# EAGLE design MEGA2560v3ProtoShield (EAGLE 7.7.0)
Mega 2560 Shield with 28-pin SOP
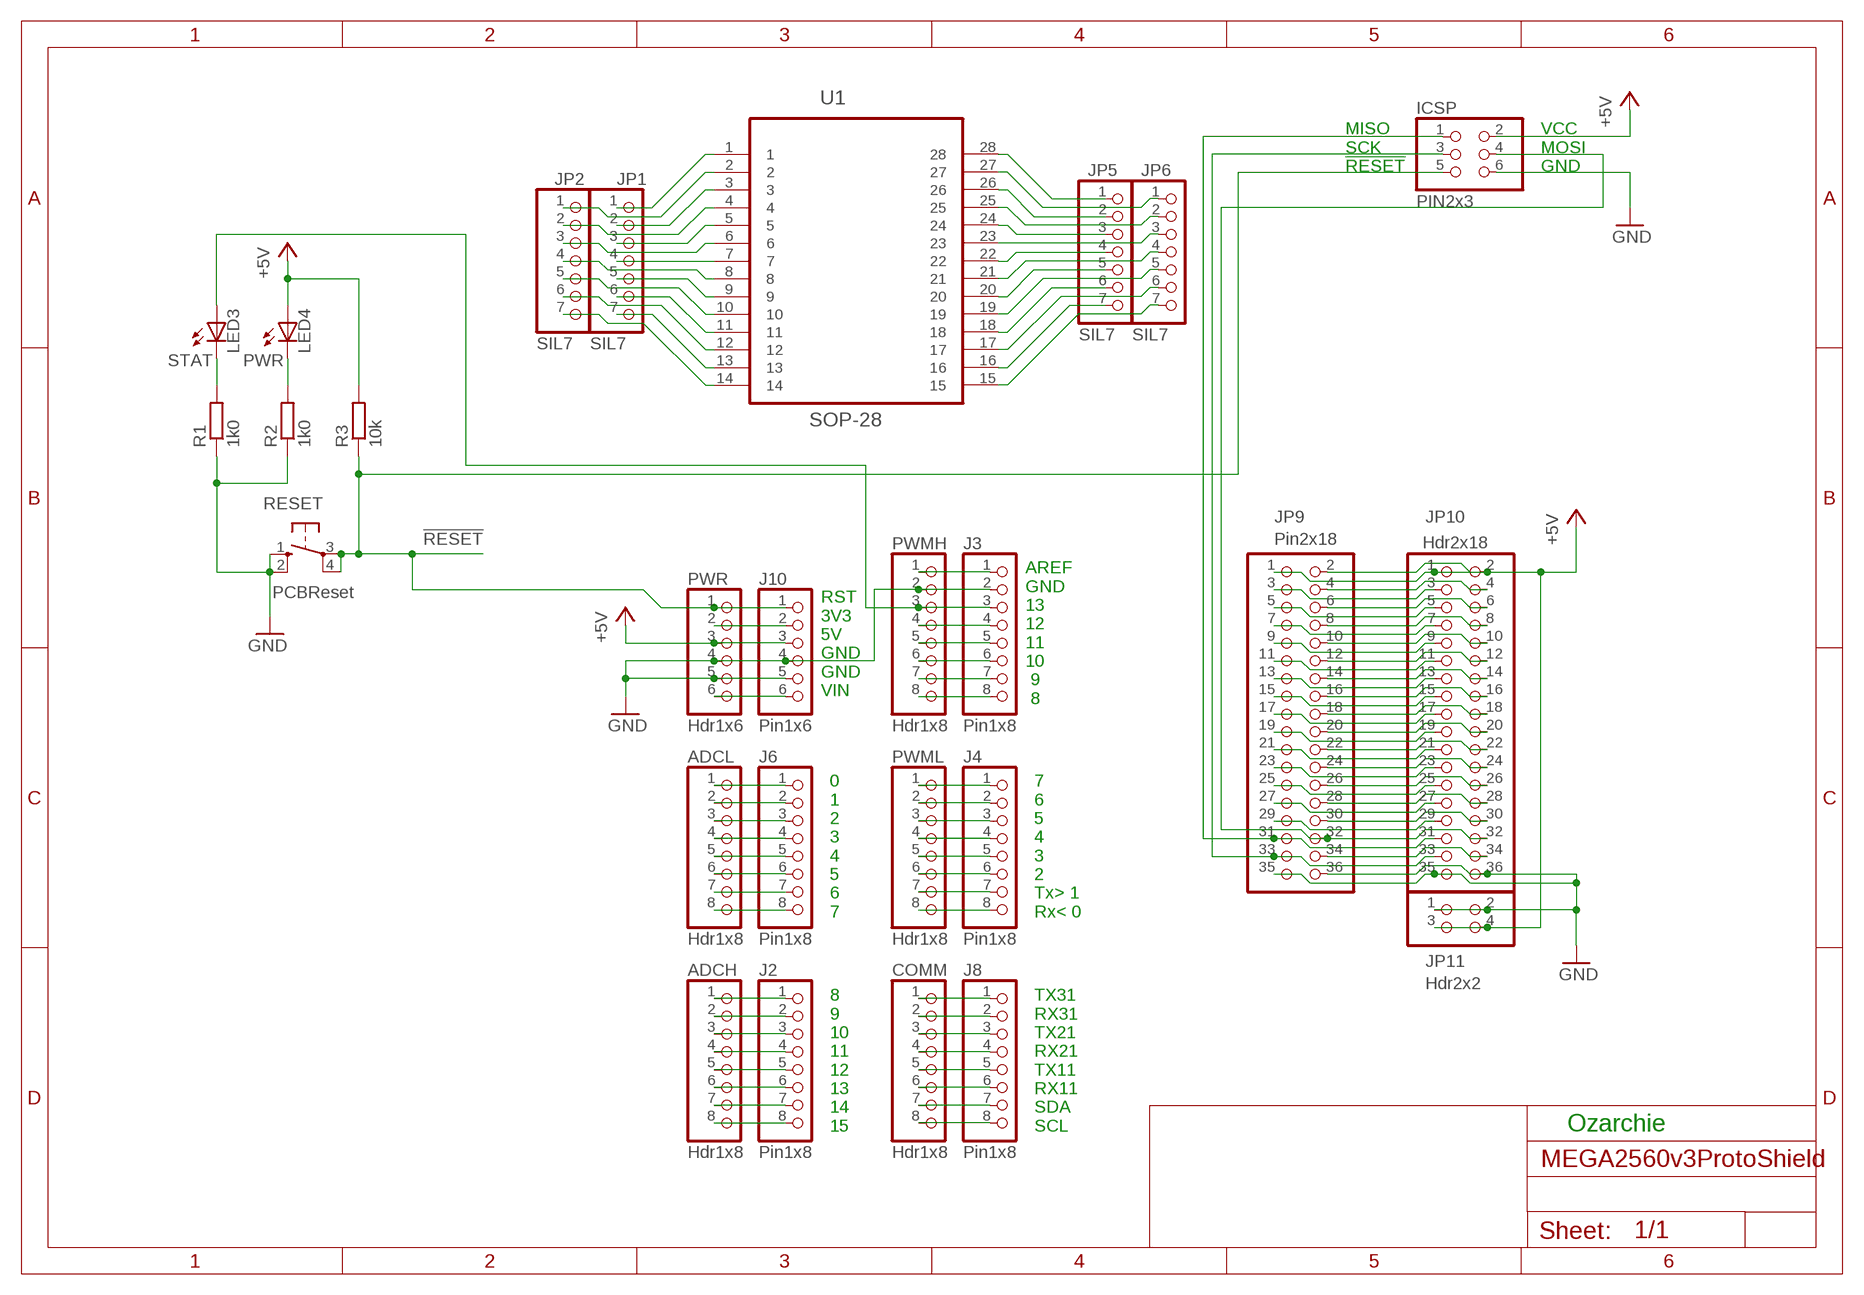
[diagram p0: schematic, sheet 1]

## Parts
ADCH  Hdr1x8  PINHD-1X8  [1X08]
ADCL  Hdr1x8  PINHD-1X8  [1X08]
COMM  Hdr1x8  PINHD-1X8  [1X08]
ICSP  PIN2x3  PINHD-2X3  [2X03]
J2  Pin1x8  PINHD-1X8  [1X08]
J3  Pin1x8  PINHD-1X8  [1X08]
J4  Pin1x8  PINHD-1X8  [1X08]
J6  Pin1x8  PINHD-1X8  [1X08]
J8  Pin1x8  PINHD-1X8  [1X08]
J10  Pin1x6  PINHD-1X6  [1X06]
JP1  SIL7  PINHD-1X7  [1X07]
JP2  SIL7  PINHD-1X7  [1X07]
JP5  SIL7  PINHD-1X7  [1X07]
JP6  SIL7  PINHD-1X7  [1X07]
JP9  Pin2x18  PINHD-2X18  [2X18]
JP10  Hdr2x18  PINHD-2X18  [2X18]
JP11  Hdr2x2  PINHD-2X2  [2X02]
LED3  STAT  LEDCHIPLED_1206  [CHIPLED_1206]
LED4  PWR  LEDCHIPLED_1206  [CHIPLED_1206]
PWMH  Hdr1x8  PINHD-1X8  [1X08]
PWML  Hdr1x8  PINHD-1X8  [1X08]
PWR  Hdr1x6  PINHD-1X6  [1X06]
R1  1k0  R-EU_R0805  [R0805]
R2  1k0  R-EU_R0805  [R0805]
R3  10k  R-EU_R0805  [R0805]
RESET  PCBReset  10-XX  [B3F-10XX]
U1  SOP-28  [SOP50P1030X264-28N]

## Nets
3V3: J10.2 PWR.2
!RESET!: ICSP.5 J10.1 PWR.1 R3.1 RESET.3(P) RESET.4(P1)
+5V: ICSP.2 J10.3 JP9.1 JP9.2 JP10.1 JP10.2 JP11.3 JP11.4 LED4.A PWR.3 R3.2
A0: ADCL.1 J6.1
A1: ADCL.2 J6.2
A2: ADCL.3 J6.3
A3: ADCL.4 J6.4
A4: ADCL.5 J6.5
A5: ADCL.6 J6.6
A6: ADCL.7 J6.7
A7: ADCL.8 J6.8
A8: ADCH.1 J2.1
A9: ADCH.2 J2.2
A10: ADCH.3 J2.3
A11: ADCH.4 J2.4
A12: ADCH.5 J2.5
A13: ADCH.6 J2.6
A14: ADCH.7 J2.7
A15: ADCH.8 J2.8
AREF: J3.1 PWMH.1
D0/RX0: J4.8 PWML.8
D1/TX0: J4.7 PWML.7
D2PWM: J4.6 PWML.6
D3PWM: J4.5 PWML.5
D4PWM: J4.4 PWML.4
D5PWM: J4.3 PWML.3
D6PWM: J4.2 PWML.2
D7PWM: J4.1 PWML.1
D8PWM: J3.8 PWMH.8
D9PWM: J3.7 PWMH.7
D10PWM: J3.6 PWMH.6
D11PWM: J3.5 PWMH.5
D12PWM: J3.4 PWMH.4
D13PWM: J3.3 LED3.A PWMH.3
D14/TX3: COMM.1 J8.1
D15/RX3: COMM.2 J8.2
D16/TX2: COMM.3 J8.3
D17/RX2: COMM.4 J8.4
D18/TX1: COMM.5 J8.5
D19/RX1: COMM.6 J8.6
D20/SDA: COMM.7 J8.7
D21/SCL: COMM.8 J8.8
D22: JP9.3 JP10.3
D23: JP9.4 JP10.4
D24: JP9.5 JP10.5
D25: JP9.6 JP10.6
D26: JP9.7 JP10.7
D27: JP9.8 JP10.8
D28: JP9.9 JP10.9
D29: JP9.10 JP10.10
D30: JP9.11 JP10.11
D31: JP9.12 JP10.12
D32: JP9.13 JP10.13
D33: JP9.14 JP10.14
D34: JP9.15 JP10.15
D35: JP9.16 JP10.16
D36: JP9.17 JP10.17
D37: JP9.18 JP10.18
D38: JP9.19 JP10.19
D39: JP9.20 JP10.20
D40: JP9.21 JP10.21
D41: JP9.22 JP10.22
D42: JP9.23 JP10.23
D43: JP9.24 JP10.24
D44: JP9.25 JP10.25
D45: JP9.26 JP10.26
D46: JP9.27 JP10.27
D47: JP9.28 JP10.28
D48: JP9.29 JP10.29
D49: JP9.30 JP10.30
D53: JP9.34 JP10.34
GND: ICSP.6 J3.2 J10.4 J10.5 JP9.35 JP9.36 JP10.35 JP10.36 JP11.1 JP11.2 PWMH.2 PWR.4 PWR.5 R1.1 R2.1 RESET.1(S) RESET.2(S1)
MISO: ICSP.1 JP9.31 JP10.31
MOSI: ICSP.4 JP9.32 JP10.32
N$10: LED3.C R1.2
N$11: LED4.C R2.2
SCK: ICSP.3 JP9.33 JP10.33
SO1: JP1.1 U1.1
SO2: JP2.1 U1.2
SO3: JP1.2 U1.3
SO4: JP2.2 U1.4
SO5: JP1.3 U1.5
SO6: JP2.3 U1.6
SO7: JP1.4 U1.7
SO8: JP2.4 U1.8
SO9: JP1.5 U1.9
SO10: JP2.5 U1.10
SO11: JP1.6 U1.11
SO12: JP2.6 U1.12
SO13: JP1.7 U1.13
SO14: JP2.7 U1.14
SO15: JP6.7 U1.15
SO16: JP5.7 U1.16
SO17: JP6.6 U1.17
SO18: JP5.6 U1.18
SO19: JP6.5 U1.19
SO20: JP5.5 U1.20
SO21: JP6.4 U1.21
SO22: JP5.4 U1.22
SO23: JP6.3 U1.23
SO24: JP5.3 U1.24
SO25: JP6.2 U1.25
SO26: JP5.2 U1.26
SO27: JP6.1 U1.27
SO28: JP5.1 U1.28
VIN: J10.6 PWR.6

## Notes on the sheet
- MISO
  SCK
  !RESET!
- VCC
  MOSI
  GND
- RST
  3V3
  5V
  GND
  GND
  VIN
- AREF
  GND
  13
  12
  11
  10
   9
   8
- 0
  1
  2
  3
  4
  5
  6
  7
- 7
  6
  5
  4
  3
  2
  Tx> 1
  Rx< 0
- 8
  9
  10
  11
  12
  13
  14
  15
- TX31
  RX31
  TX21
  RX21
  TX11
  RX11
  SDA
  SCL
- Ozarchie

## Library data of the parts
ADCH ADCL COMM J2-J4 J6 J8 PWMH PWML = MEGA2560v3ProtoShield:PINHD-1X8: PIN HEADER
ICSP = Smartprj:PINHD-2X3: PIN HEADER
J10 PWR = MEGA2560v3ProtoShield:PINHD-1X6: PIN HEADER
JP1 JP2 JP5 JP6 = MEGA2560v3ProtoShield:PINHD-1X7: PIN HEADER
JP9 JP10 = Smartprj:PINHD-2X18: PIN HEADER
JP11 = Smartprj:PINHD-2X2: PIN HEADER
LED3 LED4 = led:LED: LED OSRAM: - CHIPLED LG R971, LG N971, LY N971, LG Q971, LY Q971, LO R971, LY R971 LH N974, LH R974 LS Q976, LO Q976, LY Q976 LO Q996 - Hyper CHIPLED LW Q18S LB Q993, LB Q99A, LB R99A - SideLED LS A670, LO A670, LY A670, LG A670, LP A670 LB A673, LV A673, LT A673, LW A673 LH A674 LY A675 LS A676, LA A676, LO A676, LY A676, LW A676 LS A679, LY A679, LG A679 - Hyper Micro SIDELED® LS Y876, LA Y876, LO Y876, LY Y876 LT Y87S - SmartLED LW L88C, LW L88S LB L89C, LB L89S, LG L890 LS L89K, LO L89K, LY L89K LS L896, LA L896, LO L896, LY L896 - TOPLED LS T670, LO T670, LY T670, LG T670, LP T670 LSG T670, LSP T670, LSY T670, LOP T670, LYG T670 LG T671, LOG T671, LSG T671 LB T673, LV T673, LT T673, LW T673 LH T674 LS T676, LA T676, LO T676, LY T676, LB T676, LH T676, LSB T676, LW T676 LB T67C, LV T67C, LT T67C, LS T67K, LO T67K, LY T67K, LW E67C LS E67B, LA E67B, LO E67B, LY E67B, LB E67C, LV E67C, LT E67C LW T67C LS T679, LY T679, LG T679 LS T770, LO T770, LY T770, LG T770, LP T770 LB T773, LV T773, LT T773, LW T773 LH T774 LS E675, LA E675, LY E675, LS T675 LS T776, LA T776, LO T776, LY T776, LB T776 LHGB T686 LT T68C, LB T68C - Hyper Mini TOPLED® LB M676 - Mini TOPLED Santana® LG M470 LS M47K, LO M47K, LY M47K Source: http://www.osram.convergy.de LUXEON: - LUMILED® LXK2-PW12-R00, LXK2-PW12-S00, LXK2-PW14-U00, LXK2-PW14-V00 LXK2-PM12-R00, LXK2-PM12-S00, LXK2-PM14-U00 LXK2-PE12-Q00, LXK2-PE12-R00, LXK2-PE12-S00, LXK2-PE14-T00, LXK2-PE14-U00 LXK2-PB12-K00, LXK2-PB12-L00, LXK2-PB12-M00, LXK2-PB14-N00, LXK2-PB14-P00, LXK2-PB14-Q00 LXK2-PR12-L00, LXK2-PR12-M00, LXK2-PR14-Q00, LXK2-PR14-R00 LXK2-PD12-Q00, LXK2-PD12-R00, LXK2-PD12-S00 LXK2-PH12-R00, LXK2-PH12-S00 LXK2-PL12-P00, LXK2-PL12-Q00, LXK2-PL12-R00 Source: www.luxeon.com KINGBRIGHT: KA-3528ASYC Source: www.kingbright.com
R1-R3 = resistor:R-EU_: RESISTOR, European symbol
RESET = switch-omron:10-XX: OMRON SWITCH; MPN: B3F-1000; OC_FARNELL: 176432; OC_NEWARK: 36M3542
U1 = pmc:SOP-28: SOP28 PAD Pattern

## Board
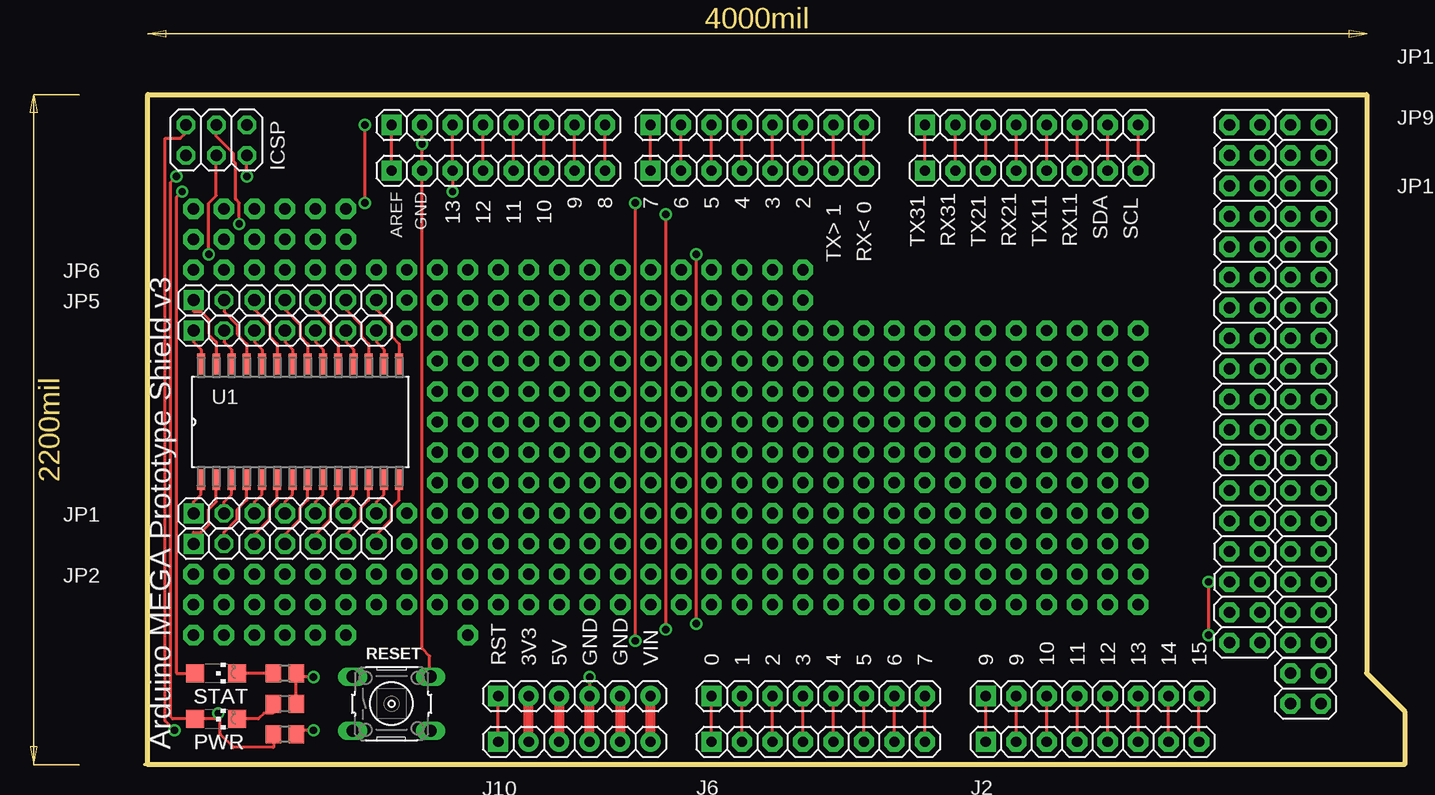
[diagram p1: board, top side]
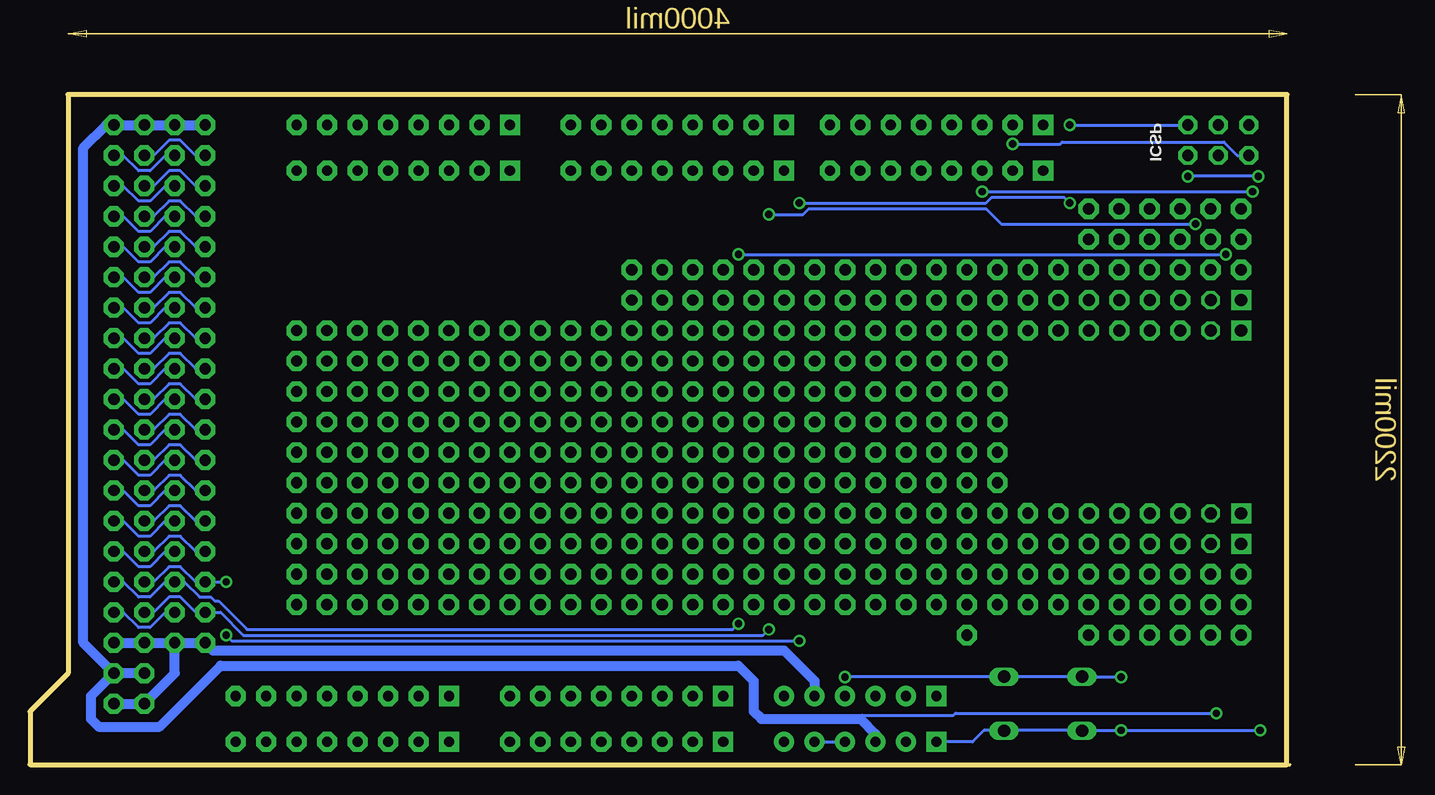
[diagram p2: board, bottom side, seen from below]

Size 105.05 x 55.88 mm. Coordinates in mm from the lower left corner, seen from the top.
Outline: 0.27,0 0,0
Outline: 0.27,0 0.27,55.88 101.87,55.88 101.87,7.62 105.05,4.45 105.05,0 0.27,0
Copper layers (1*16): Top 0.035mm / dielectric 1.5mm / Bottom 0.035mm
Design rules "default *": minimum track width 10mil, minimum drill 24mil, track to track 8mil, track to pad 8mil, pad to pad 8mil, via to via 8mil, smd to smd 8mil, copper to edge 40mil, drill to drill 8mil, minimum pad ring 10mil, minimum via ring 8mil, stop-mask expansion 2mil, vias tented up to drill 0mil, thermal gap 10mil

### Footprints (pad centres in the part's own frame; a part is rotated, then mirrored left to right if it is on the bottom)
1X08 = drill 0.85 pad 1.676 square: 1 -8.89,0 | drill 0.85 pad 1.676 octagon: 2 -6.35,0; 3 -3.81,0; 4 -1.27,0; 5 1.27,0; 6 3.81,0; 7 6.35,0; 8 8.89,0
2X03 = drill 0.95 pad 1.55 octagon: 1 -2.54,-1.27; 2 -2.54,1.27; 3 0,-1.27; 4 0,1.27; 5 2.54,-1.27; 6 2.54,1.27
1X06 = drill 0.85 pad 1.676 square: 1 -6.35,0 | drill 0.85 pad 1.676: 2 -3.81,0; 3 -1.27,0; 4 1.27,0; 5 3.81,0; 6 6.35,0
1X07 = drill 1.016 pad 1.676 square: 1 -7.62,0 | drill 1.016 octagon: 2 -5.08,0 | drill 1.016 pad 1.676 octagon: 3 -2.54,0; 4 0,0; 5 2.54,0; 6 5.08,0; 7 7.62,0
2X18 = drill 0.95 pad 1.676 octagon: 1 -21.59,-1.27; 2 -21.59,1.27; 3 -19.05,-1.27; 4 -19.05,1.27; 5 -16.51,-1.27; 6 -16.51,1.27; 7 -13.97,-1.27; 8 -13.97,1.27; 9 -11.43,-1.27; 10 -11.43,1.27; 11 -8.89,-1.27; 12 -8.89,1.27; 13 -6.35,-1.27; 14 -6.35,1.27; 15 -3.81,-1.27; 16 -3.81,1.27; 17 -1.27,-1.27; 18 -1.27,1.27; 19 1.27,-1.27; 20 1.27,1.27; 21 3.81,-1.27; 22 3.81,1.27; 23 6.35,-1.27; 24 6.35,1.27; 25 8.89,-1.27; 26 8.89,1.27; 27 11.43,-1.27; 28 11.43,1.27; 29 13.97,-1.27; 30 13.97,1.27; 31 16.51,-1.27; 32 16.51,1.27; 33 19.05,-1.27; 34 19.05,1.27; 35 21.59,-1.27; 36 21.59,1.27
2X02 = drill 0.95 pad 1.676 octagon: 1 -1.27,-1.27; 2 -1.27,1.27; 3 1.27,-1.27; 4 1.27,1.27
CHIPLED_1206 = smd 1.5 x 1.5: A 0,-1.75; C 0,1.75
R0805 = smd 1.3 x 1.5: 1 -0.95,0; 2 0.95,0
B3F-10XX = drill 1.016 long: 1 -3.251,2.261; 2 3.251,2.261; 3 -3.251,-2.261; 4 3.251,-2.261
SOP50P1030X264-28N = smd 1.727 x 0.66: 1 -4.826,8.255; 2 -4.826,6.985; 3 -4.826,5.715; 4 -4.826,4.445; 5 -4.826,3.175; 6 -4.826,1.905; 7 -4.826,0.635; 8 -4.826,-0.635; 9 -4.826,-1.905; 10 -4.826,-3.175; 11 -4.826,-4.445; 12 -4.826,-5.715; 13 -4.826,-6.985; 14 -4.826,-8.255; 15 4.826,-8.255; 16 4.826,-6.985; 17 4.826,-5.715; 18 4.826,-4.445; 19 4.826,-3.175; 20 4.826,-1.905; 21 4.826,-0.635; 22 4.826,0.635; 23 4.826,1.905; 24 4.826,3.175; 25 4.826,4.445; 26 4.826,5.715; 27 4.826,6.985; 28 4.826,8.255

### Placement (x,y rotation side)
ADCH  79.01,1.91 0 top
ADCL  56.15,1.91 0 top
COMM  73.93,49.53 0 top
ICSP  5.98,52.07 180 top
J2  79.01,5.71 0 top
J3  29.48,53.34 0 top
J4  51.07,53.34 0 top
J6  56.15,5.71 0 top
J8  73.93,53.34 0 top
J10  35.83,5.71 0 top
JP1  11.7,20.95 0 top
JP2  11.7,18.41 0 top
JP5  11.7,36.2 0 top
JP6  11.7,38.73 0 top
JP9  96.79,31.75 270 top
JP10  91.71,31.75 270 top
JP11  96.79,6.35 90 top
LED3  5.98,7.62 270 top
LED4  5.98,3.81 270 top
PWMH  29.48,49.53 0 top
PWML  51.07,49.53 0 top
PWR  35.83,1.91 0 top
R1  11.7,7.62 180 top
R2  11.7,5.08 180 top
R3  11.7,2.54 180 top
RESET  20.59,5.08 0 top
U1  12.97,28.57 90 top

### Tracks (layer width: path | path; a pad name or v marks a point on that pad's centre or on a via)
3V3
  Top 0.813: PWR.2 J10.2
!RESET!  (via drill 0.61)
  Top 0.254: PWR.1 J10.1 | v14.08,2.86 12.97,2.86 R3.1 | ICSP.5 3.44,52.7 2.97,52.23 1.7,52.23 1.7,3.65 v2.49,2.86
  Bottom 0.254: v2.49,2.86 v14.08,2.86 17.26,2.86 RESET.3 17.41,2.86 23.77,2.86 RESET.4 23.92,2.86 25.51,2.86 26.46,1.91 PWR.1
+5V  (via drill 0.61)
  Top 0.254: 6.14,3.81 6.3,3.81 6.3,2.54 7.41,1.43 10.75,1.43 R3.2 | 6.14,3.81 LED4.A 2.33,3.81 2.17,3.97 2.17,48.58 v2.65,49.05 | v8.53,49.05 ICSP.2 | v6.14,4.29 6.14,3.81
  Top 0.813: J10.3 PWR.3
  Bottom 0.254: v2.65,49.05 v8.53,49.05 | v6.14,4.29 27.89,4.29 28.05,4.13 35.67,4.13 35.83,3.81
  Bottom 0.813: JP11.3 100.6,10.16 100.6,51.44 98.69,53.34 JP9.2 JP9.1 JP10.2 JP10.1 | PWR.3 34.56,2.54 35.83,3.81 44.09,3.81 44.72,4.45 44.72,6.99 45.99,8.26 89.17,8.26 94.25,3.17 99.33,3.17 99.96,3.81 99.96,5.71 JP11.3 | JP11.4 JP11.3
A0
  Top 0.254: ADCL.1 J6.1
A1
  Top 0.254: ADCL.2 J6.2
A2
  Top 0.254: ADCL.3 J6.3
A3
  Top 0.254: ADCL.4 J6.4
A4
  Top 0.254: ADCL.5 J6.5
A5
  Top 0.254: ADCL.6 J6.6
A6
  Top 0.254: ADCL.7 J6.7
A7
  Top 0.254: ADCL.8 J6.8
A8
  Top 0.254: ADCH.1 J2.1
A9
  Top 0.254: ADCH.2 J2.2
A10
  Top 0.254: ADCH.3 J2.3
A11
  Top 0.254: ADCH.4 J2.4
A12
  Top 0.254: ADCH.5 J2.5
A13
  Top 0.254: ADCH.6 J2.6
A14
  Top 0.254: ADCH.7 J2.7
A15
  Top 0.254: ADCH.8 J2.8
AREF
  Top 0.254: PWMH.1 J3.1
D0/RX0
  Top 0.254: PWML.8 J4.8
D1/TX0
  Top 0.254: PWML.7 J4.7
D2PWM
  Top 0.254: PWML.6 J4.6
D3PWM
  Top 0.254: PWML.5 J4.5
D4PWM
  Top 0.254: PWML.4 J4.4
D5PWM
  Top 0.254: PWML.3 J4.3
D6PWM
  Top 0.254: PWML.2 J4.2
D7PWM
  Top 0.254: PWML.1 J4.1
D8PWM
  Top 0.254: PWMH.8 J3.8
D9PWM
  Top 0.254: PWMH.7 J3.7
D10PWM
  Top 0.254: PWMH.6 J3.6
D11PWM
  Top 0.254: PWMH.5 J3.5
D12PWM
  Top 0.254: PWMH.4 J3.4
D13PWM  (via drill 0.61)
  Top 0.254: J3.3 PWMH.3 v25.67,47.78 | LED3.A 2.65,7.62 2.65,47.31 v3.13,47.78
  Bottom 0.254: v25.67,47.78 v3.13,47.78
D14/TX3
  Top 0.254: COMM.1 J8.1
D15/RX3
  Top 0.254: COMM.2 J8.2
D16/TX2
  Top 0.254: COMM.3 J8.3
D17/RX2
  Top 0.254: COMM.4 J8.4
D18/TX1
  Top 0.254: COMM.5 J8.5
D19/RX1
  Top 0.254: COMM.6 J8.6
D20/SDA
  Top 0.254: COMM.7 J8.7
D21/SCL
  Top 0.254: COMM.8 J8.8
D22
  Bottom 0.254: JP9.3 94.73,50.8 93.46,52.07 92.5,52.07 91.23,50.8 JP10.3
D23
  Bottom 0.254: JP9.4 97.27,50.8 96,49.53 95.04,49.53 93.77,50.8 JP10.4
D24
  Bottom 0.254: JP9.5 94.73,48.26 93.46,49.53 92.5,49.53 91.23,48.26 JP10.5
D25
  Bottom 0.254: JP9.6 97.27,48.26 96,46.99 95.04,46.99 93.77,48.26 JP10.6
D26
  Bottom 0.254: JP9.7 94.73,45.72 93.46,46.99 92.5,46.99 91.23,45.72 JP10.7
D27
  Bottom 0.254: JP9.8 97.27,45.72 96,44.45 95.04,44.45 93.77,45.72 JP10.8
D28
  Bottom 0.254: JP9.9 94.73,43.18 93.46,44.45 92.5,44.45 91.23,43.18 JP10.9
D29
  Bottom 0.254: JP9.10 97.27,43.18 96,41.91 95.04,41.91 93.77,43.18 JP10.10
D30
  Bottom 0.254: JP9.11 94.73,40.64 93.46,41.91 92.5,41.91 91.23,40.64 JP10.11
D31
  Bottom 0.254: JP9.12 97.27,40.64 96,39.37 95.04,39.37 93.77,40.64 JP10.12
D32
  Bottom 0.254: JP9.13 94.73,38.1 93.46,39.37 92.5,39.37 91.23,38.1 JP10.13
D33
  Bottom 0.254: JP9.14 97.27,38.1 96,36.83 95.04,36.83 93.77,38.1 JP10.14
D34
  Bottom 0.254: JP9.15 94.73,35.56 93.46,36.83 92.5,36.83 91.23,35.56 JP10.15
D35
  Bottom 0.254: JP9.16 97.27,35.56 96,34.29 95.04,34.29 93.77,35.56 JP10.16
D36
  Bottom 0.254: JP9.17 94.73,33.02 93.46,34.29 92.5,34.29 91.23,33.02 JP10.17
D37
  Bottom 0.254: JP9.18 97.27,33.02 96,31.75 95.04,31.75 93.77,33.02 JP10.18
D38
  Bottom 0.254: JP9.19 94.73,30.48 93.46,31.75 92.5,31.75 91.23,30.48 JP10.19
D39
  Bottom 0.254: JP9.20 97.27,30.48 96,29.21 95.04,29.21 93.77,30.48 JP10.20
D40
  Bottom 0.254: JP9.21 94.73,27.94 93.46,29.21 92.5,29.21 91.23,27.94 JP10.21
D41
  Bottom 0.254: JP9.22 97.27,27.94 96,26.67 95.04,26.67 93.77,27.94 JP10.22
D42
  Bottom 0.254: JP9.23 94.73,25.4 93.46,26.67 92.5,26.67 91.23,25.4 JP10.23
D43
  Bottom 0.254: JP9.24 97.27,25.4 96,24.13 95.04,24.13 93.77,25.4 JP10.24
D44
  Bottom 0.254: JP9.25 94.73,22.86 93.46,24.13 92.5,24.13 91.23,22.86 JP10.25
D45
  Bottom 0.254: JP9.26 97.27,22.86 96,21.59 95.04,21.59 93.77,22.86 JP10.26
D46
  Bottom 0.254: JP9.27 94.73,20.32 93.46,21.59 92.5,21.59 91.23,20.32 JP10.27
D47
  Bottom 0.254: JP9.28 97.27,20.32 96,19.05 95.04,19.05 93.77,20.32 JP10.28
D48
  Bottom 0.254: JP9.29 94.73,17.78 93.46,19.05 92.5,19.05 91.23,17.78 JP10.29
D49
  Bottom 0.254: JP9.30 97.27,17.78 96,16.51 95.04,16.51 93.77,17.78 JP10.30
D53
  Bottom 0.254: JP9.34 97.27,12.7 96,11.43 95.04,11.43 93.77,12.7 JP10.34
GND  (via drill 0.61)
  Top 0.254: J3.2 v23.13,51.75 PWMH.2 23.13,9.68 23.77,9.05 23.77,7.46 RESET.2 | 12.65,7.3 R2.1 | 12.65,7.3 R1.1 12.65,7.3 | v14.08,7.3 12.65,7.3 | v37.1,7.3 J10.4
  Top 0.813: J10.5 PWR.5 | PWR.4 J10.4
  Bottom 0.254: ICSP.6 4.4,50.8 5.51,51.91 19,51.91 19.16,51.75 v23.13,51.75 | PWR.5 PWR.4 | v14.08,7.3 17.26,7.3 RESET.1 17.41,7.3 23.77,7.3 RESET.2 23.92,7.3 v37.1,7.3
  Bottom 0.813: JP9.36 JP9.35 JP10.36 | JP10.36 JP10.35 89.8,9.53 42.18,9.53 39.64,6.99 J10.5 | JP11.1 JP11.2 92.98,7.62 JP10.36
MISO  (via drill 0.61)
  Top 0.254: v18.37,46.83 v18.37,53.34 | v40.91,10.32 v40.91,46.83 | v88.69,15.24 v88.69,10.79
  Bottom 0.254: JP9.31 94.73,15.24 93.46,16.51 92.5,16.51 91.23,15.24 JP10.31 v88.69,15.24 | v18.37,53.34 ICSP.1 | v18.37,46.83 18.84,47.31 24.88,47.31 25.35,46.83 v40.91,46.83 | v40.91,10.32 88.22,10.32 v88.69,10.79
MOSI  (via drill 0.61)
  Top 0.254: ICSP.4 5.98,47.47 5.35,46.83 v5.35,42.55 | v45.99,11.75 v45.99,42.55
  Bottom 0.254: JP9.32 97.27,15.24 96,13.97 95.04,13.97 93.77,15.24 JP10.32 92.19,15.24 90.92,13.97 89.96,13.97 89.65,13.65 89.33,13.65 86.95,11.27 46.47,11.27 v45.99,11.75 | v45.99,42.55 v5.35,42.55
N$4  (via drill 0.95 pad 1.7)
  other vias: 72.66,15.88
N$10
  Top 0.254: R1.2 LED3.C
N$11
  Top 0.254: LED4.C 9.48,3.81 9.95,4.29 10.75,4.29 R2.2
N$13  (via drill 0.95 pad 1.7)
  other vias: 6.62,41.27
N$14  (via drill 0.95 pad 1.7)
  other vias: 4.08,41.27
N$16  (via drill 0.95 pad 1.7)
  other vias: 6.62,43.81
N$17  (via drill 0.95 pad 1.7)
  other vias: 6.62,46.35
N$25  (via drill 0.95 pad 1.7)
  other vias: 9.16,41.27
N$26  (via drill 0.95 pad 1.7)
  other vias: 11.7,41.27
N$27  (via drill 0.95 pad 1.7)
  other vias: 16.78,41.27
N$28  (via drill 0.95 pad 1.7)
  other vias: 14.24,41.27
N$29  (via drill 0.95 pad 1.7)
  other vias: 14.24,43.81
N$30  (via drill 0.95 pad 1.7)
  other vias: 11.7,43.81
N$31  (via drill 0.95 pad 1.7)
  other vias: 9.16,43.81
N$32  (via drill 0.95 pad 1.7)
  other vias: 9.16,46.35
N$33  (via drill 0.95 pad 1.7)
  other vias: 11.7,46.35
N$34  (via drill 0.95 pad 1.7)
  other vias: 16.78,43.81
N$35  (via drill 0.95 pad 1.7)
  other vias: 16.78,46.35
N$36  (via drill 0.95 pad 1.7)
  other vias: 14.24,46.35
N$37  (via drill 0.95 pad 1.7)
  other vias: 4.08,43.81
N$39  (via drill 0.95 pad 1.7)
  other vias: 4.08,46.35
N$40  (via drill 0.95 pad 1.7)
  other vias: 6.62,10.79
N$41  (via drill 0.95 pad 1.7)
  other vias: 4.08,10.79
N$42  (via drill 0.95 pad 1.7)
  other vias: 6.62,13.34
N$43  (via drill 0.95 pad 1.7)
  other vias: 6.62,15.88
N$44  (via drill 0.95 pad 1.7)
  other vias: 9.16,10.79
N$45  (via drill 0.95 pad 1.7)
  other vias: 65.04,15.88
N$46  (via drill 0.95 pad 1.7)
  other vias: 65.04,31.11
N$47  (via drill 0.95 pad 1.7)
  other vias: 65.04,28.57
N$48  (via drill 0.95 pad 1.7)
  other vias: 11.7,10.79
N$49  (via drill 0.95 pad 1.7)
  other vias: 65.04,26.04
N$50  (via drill 0.95 pad 1.7)
  other vias: 14.24,10.79
N$51  (via drill 0.95 pad 1.7)
  other vias: 14.24,13.34
N$52  (via drill 0.95 pad 1.7)
  other vias: 11.7,13.34
N$53  (via drill 0.95 pad 1.7)
  other vias: 9.16,13.34
N$54  (via drill 0.95 pad 1.7)
  other vias: 9.16,15.88
N$55  (via drill 0.95 pad 1.7)
  other vias: 11.7,15.88
N$56  (via drill 0.95 pad 1.7)
  other vias: 16.78,13.34
N$57  (via drill 0.95 pad 1.7)
  other vias: 65.04,23.5
N$58  (via drill 0.95 pad 1.7)
  other vias: 65.04,20.95
N$59  (via drill 0.95 pad 1.7)
  other vias: 65.04,18.41
N$60  (via drill 0.95 pad 1.7)
  other vias: 16.78,15.88
N$61  (via drill 0.95 pad 1.7)
  other vias: 14.24,15.88
N$62  (via drill 0.95 pad 1.7)
  other vias: 4.08,13.34
N$65  (via drill 0.95 pad 1.7)
  other vias: 4.08,15.88
N$66  (via drill 0.95 pad 1.7)
  other vias: 19.32,41.27
N$67  (via drill 0.95 pad 1.7)
  other vias: 24.4,41.27
N$68  (via drill 0.95 pad 1.7)
  other vias: 21.86,41.27
N$69  (via drill 0.95 pad 1.7)
  other vias: 44.72,13.34
N$70  (via drill 0.95 pad 1.7)
  other vias: 29.48,13.34
N$71  (via drill 0.95 pad 1.7)
  other vias: 26.94,13.34
N$72  (via drill 0.95 pad 1.7)
  other vias: 24.4,36.2
N$73  (via drill 0.95 pad 1.7)
  other vias: 21.86,36.2
N$74  (via drill 0.95 pad 1.7)
  other vias: 24.4,38.73
N$75  (via drill 0.95 pad 1.7)
  other vias: 21.86,38.73
N$76  (via drill 0.95 pad 1.7)
  other vias: 65.04,33.66
N$77  (via drill 0.95 pad 1.7)
  other vias: 26.94,10.79
N$78  (via drill 0.95 pad 1.7)
  other vias: 24.4,13.34
N$79  (via drill 0.95 pad 1.7)
  other vias: 24.4,15.88
N$80  (via drill 0.95 pad 1.7)
  other vias: 24.4,18.41
N$81  (via drill 0.95 pad 1.7)
  other vias: 59.96,15.88
N$82  (via drill 0.95 pad 1.7)
  other vias: 29.48,15.88
N$83  (via drill 0.95 pad 1.7)
  other vias: 26.94,15.88
N$84  (via drill 0.95 pad 1.7)
  other vias: 24.4,20.95
N$85  (via drill 0.95 pad 1.7)
  other vias: 24.4,23.5
N$86  (via drill 0.95 pad 1.7)
  other vias: 24.4,26.04
N$87  (via drill 0.95 pad 1.7)
  other vias: 24.4,31.11
N$90  (via drill 0.95 pad 1.7)
  other vias: 24.4,33.66
N$91  (via drill 0.95 pad 1.7)
  other vias: 54.88,28.57
N$92  (via drill 0.95 pad 1.7)
  other vias: 24.4,28.57
N$93  (via drill 0.95 pad 1.7)
  other vias: 62.5,18.41
N$94  (via drill 0.95 pad 1.7)
  other vias: 29.48,18.41
N$95  (via drill 0.95 pad 1.7)
  other vias: 26.94,18.41
N$96  (via drill 0.95 pad 1.7)
  other vias: 59.96,28.57
N$105  (via drill 0.95 pad 1.7)
  other vias: 70.12,20.95
N$106  (via drill 0.95 pad 1.7)
  other vias: 29.48,20.95
N$107  (via drill 0.95 pad 1.7)
  other vias: 26.94,20.95
N$108  (via drill 0.95 pad 1.7)
  other vias: 62.5,26.04
N$114  (via drill 0.95 pad 1.7)
  other vias: 59.96,26.04
N$115  (via drill 0.95 pad 1.7)
  other vias: 59.96,20.95
N$117  (via drill 0.95 pad 1.7)
  other vias: 62.5,23.5
N$118  (via drill 0.95 pad 1.7)
  other vias: 21.86,20.95
N$119  (via drill 0.95 pad 1.7)
  other vias: 29.48,23.5
N$120  (via drill 0.95 pad 1.7)
  other vias: 26.94,23.5
N$122  (via drill 0.95 pad 1.7)
  other vias: 54.88,20.95
N$123  (via drill 0.95 pad 1.7)
  other vias: 26.94,41.27
N$131  (via drill 0.95 pad 1.7)
  other vias: 29.48,26.04
N$132  (via drill 0.95 pad 1.7)
  other vias: 26.94,26.04
N$135  (via drill 0.95 pad 1.7)
  other vias: 26.94,28.57
N$141  (via drill 0.95 pad 1.7)
  other vias: 67.58,15.88
N$143  (via drill 0.95 pad 1.7)
  other vias: 29.48,28.57
N$153  (via drill 0.95 pad 1.7)
  other vias: 57.42,31.11
N$155  (via drill 0.95 pad 1.7)
  other vias: 29.48,31.11
N$156  (via drill 0.95 pad 1.7)
  other vias: 26.94,31.11
N$165  (via drill 0.95 pad 1.7)
  other vias: 52.34,33.66
N$167  (via drill 0.95 pad 1.7)
  other vias: 29.48,33.66
N$168  (via drill 0.95 pad 1.7)
  other vias: 26.94,33.66
N$177  (via drill 0.95 pad 1.7)
  other vias: 44.72,36.2
N$178  (via drill 0.95 pad 1.7)
  other vias: 67.58,31.11
N$179  (via drill 0.95 pad 1.7)
  other vias: 29.48,36.2
N$180  (via drill 0.95 pad 1.7)
  other vias: 26.94,36.2
N$185  (via drill 0.95 pad 1.7)
  other vias: 70.12,36.2
N$186  (via drill 0.95 pad 1.7)
  other vias: 70.12,31.11
N$187  (via drill 0.95 pad 1.7)
  other vias: 70.12,28.57
N$188  (via drill 0.95 pad 1.7)
  other vias: 70.12,26.04
N$189  (via drill 0.95 pad 1.7)
  other vias: 16.78,10.79
N$190  (via drill 0.95 pad 1.7)
  other vias: 21.86,18.41
N$191  (via drill 0.95 pad 1.7)
  other vias: 29.48,38.73
N$192  (via drill 0.95 pad 1.7)
  other vias: 26.94,38.73
N$193  (via drill 0.95 pad 1.7)
  other vias: 70.12,23.5
N$194  (via drill 0.95 pad 1.7)
  other vias: 70.12,18.41
N$197  (via drill 0.95 pad 1.7)
  other vias: 70.12,33.66
N$198  (via drill 0.95 pad 1.7)
  other vias: 72.66,31.11
N$199  (via drill 0.95 pad 1.7)
  other vias: 72.66,28.57
N$200  (via drill 0.95 pad 1.7)
  other vias: 72.66,26.04
N$201  (via drill 0.95 pad 1.7)
  other vias: 39.64,41.27
N$202  (via drill 0.95 pad 1.7)
  other vias: 72.66,23.5
N$203  (via drill 0.95 pad 1.7)
  other vias: 29.48,41.27
N$204  (via drill 0.95 pad 1.7)
  other vias: 72.66,20.95
N$205  (via drill 0.95 pad 1.7)
  other vias: 72.66,18.41
N$208  (via drill 0.95 pad 1.7)
  other vias: 72.66,36.2
N$209  (via drill 0.95 pad 1.7)
  other vias: 72.66,33.66
N$210  (via drill 0.95 pad 1.7)
  other vias: 75.2,15.88
N$211  (via drill 0.95 pad 1.7)
  other vias: 75.2,31.11
N$212  (via drill 0.95 pad 1.7)
  other vias: 75.2,28.57
N$213  (via drill 0.95 pad 1.7)
  other vias: 75.2,26.04
N$214  (via drill 0.95 pad 1.7)
  other vias: 75.2,23.5
N$215  (via drill 0.95 pad 1.7)
  other vias: 75.2,20.95
N$216  (via drill 0.95 pad 1.7)
  other vias: 75.2,18.41
N$219  (via drill 0.95 pad 1.7)
  other vias: 34.56,26.04
N$220  (via drill 0.95 pad 1.7)
  other vias: 37.1,26.04
N$221  (via drill 0.95 pad 1.7)
  other vias: 75.2,36.2
N$224  (via drill 0.95 pad 1.7)
  other vias: 75.2,33.66
N$225  (via drill 0.95 pad 1.7)
  other vias: 77.74,15.88
N$226  (via drill 0.95 pad 1.7)
  other vias: 77.74,31.11
N$227  (via drill 0.95 pad 1.7)
  other vias: 32.02,36.2
N$228  (via drill 0.95 pad 1.7)
  other vias: 34.56,36.2
N$229  (via drill 0.95 pad 1.7)
  other vias: 32.02,33.66
N$230  (via drill 0.95 pad 1.7)
  other vias: 34.56,33.66
N$231  (via drill 0.95 pad 1.7)
  other vias: 32.02,31.11
N$232  (via drill 0.95 pad 1.7)
  other vias: 34.56,31.11
N$233  (via drill 0.95 pad 1.7)
  other vias: 37.1,33.66
N$234  (via drill 0.95 pad 1.7)
  other vias: 37.1,31.11
N$235  (via drill 0.95 pad 1.7)
  other vias: 34.56,28.57
N$236  (via drill 0.95 pad 1.7)
  other vias: 37.1,28.57
N$237  (via drill 0.95 pad 1.7)
  other vias: 39.64,31.11
N$238  (via drill 0.95 pad 1.7)
  other vias: 39.64,33.66
N$239  (via drill 0.95 pad 1.7)
  other vias: 39.64,28.57
N$240  (via drill 0.95 pad 1.7)
  other vias: 42.18,31.11
N$241  (via drill 0.95 pad 1.7)
  other vias: 42.18,33.66
N$242  (via drill 0.95 pad 1.7)
  other vias: 39.64,36.2
N$243  (via drill 0.95 pad 1.7)
  other vias: 37.1,36.2
N$244  (via drill 0.95 pad 1.7)
  other vias: 77.74,28.57
N$245  (via drill 0.95 pad 1.7)
  other vias: 34.56,38.73
N$246  (via drill 0.95 pad 1.7)
  other vias: 37.1,38.73
N$247  (via drill 0.95 pad 1.7)
  other vias: 32.02,38.73
N$248  (via drill 0.95 pad 1.7)
  other vias: 32.02,41.27
N$249  (via drill 0.95 pad 1.7)
  other vias: 34.56,41.27
N$250  (via drill 0.95 pad 1.7)
  other vias: 77.74,26.04
N$251  (via drill 0.95 pad 1.7)
  other vias: 32.02,28.57
N$252  (via drill 0.95 pad 1.7)
  other vias: 32.02,26.04
N$253  (via drill 0.95 pad 1.7)
  other vias: 77.74,23.5
N$254  (via drill 0.95 pad 1.7)
  other vias: 77.74,20.95
N$255  (via drill 0.95 pad 1.7)
  other vias: 77.74,18.41
N$258  (via drill 0.95 pad 1.7)
  other vias: 77.74,36.2
N$259  (via drill 0.95 pad 1.7)
  other vias: 34.56,20.95
N$260  (via drill 0.95 pad 1.7)
  other vias: 77.74,33.66
N$261  (via drill 0.95 pad 1.7)
  other vias: 37.1,20.95
N$262  (via drill 0.95 pad 1.7)
  other vias: 39.64,20.95
N$263  (via drill 0.95 pad 1.7)
  other vias: 42.18,20.95
N$264  (via drill 0.95 pad 1.7)
  other vias: 80.28,15.88
N$265  (via drill 0.95 pad 1.7)
  other vias: 80.28,31.11
N$266  (via drill 0.95 pad 1.7)
  other vias: 80.28,28.57
N$267  (via drill 0.95 pad 1.7)
  other vias: 44.72,28.57
N$268  (via drill 0.95 pad 1.7)
  other vias: 42.18,28.57
N$269  (via drill 0.95 pad 1.7)
  other vias: 47.26,28.57
N$270  (via drill 0.95 pad 1.7)
  other vias: 80.28,26.04
N$271  (via drill 0.95 pad 1.7)
  other vias: 32.02,23.5
N$272  (via drill 0.95 pad 1.7)
  other vias: 32.02,20.95
N$273  (via drill 0.95 pad 1.7)
  other vias: 32.02,18.41
N$274  (via drill 0.95 pad 1.7)
  other vias: 34.56,13.34
N$275  (via drill 0.95 pad 1.7)
  other vias: 34.56,15.88
N$276  (via drill 0.95 pad 1.7)
  other vias: 39.64,15.88
N$277  (via drill 0.95 pad 1.7)
  other vias: 37.1,15.88
N$278  (via drill 0.95 pad 1.7)
  other vias: 37.1,13.34
N$279  (via drill 0.95 pad 1.7)
  other vias: 32.02,13.34
N$280  (via drill 0.95 pad 1.7)
  other vias: 32.02,15.88
N$281  (via drill 0.95 pad 1.7)
  other vias: 39.64,18.41
N$282  (via drill 0.95 pad 1.7)
  other vias: 42.18,18.41
N$283  (via drill 0.95 pad 1.7)
  other vias: 39.64,13.34
N$284  (via drill 0.95 pad 1.7)
  other vias: 67.58,28.57
N$285  (via drill 0.95 pad 1.7)
  other vias: 67.58,26.04
N$286  (via drill 0.95 pad 1.7)
  other vias: 67.58,23.5
N$287  (via drill 0.95 pad 1.7)
  other vias: 80.28,23.5
N$288  (via drill 0.95 pad 1.7)
  other vias: 80.28,20.95
N$289  (via drill 0.95 pad 1.7)
  other vias: 67.58,20.95
N$290  (via drill 0.95 pad 1.7)
  other vias: 67.58,18.41
N$291  (via drill 0.95 pad 1.7)
  other vias: 67.58,33.66
N$292  (via drill 0.95 pad 1.7)
  other vias: 65.04,13.34
N$293  (via drill 0.95 pad 1.7)
  other vias: 42.18,15.88
N$294  (via drill 0.95 pad 1.7)
  other vias: 44.72,15.88
N$295  (via drill 0.95 pad 1.7)
  other vias: 44.72,18.41
N$296  (via drill 0.95 pad 1.7)
  other vias: 47.26,18.41
N$297  (via drill 0.95 pad 1.7)
  other vias: 47.26,20.95
N$298  (via drill 0.95 pad 1.7)
  other vias: 44.72,20.95
N$299  (via drill 0.95 pad 1.7)
  other vias: 49.8,20.95
N$300  (via drill 0.95 pad 1.7)
  other vias: 80.28,18.41
N$303  (via drill 0.95 pad 1.7)
  other vias: 80.28,36.2
N$304  (via drill 0.95 pad 1.7)
  other vias: 52.34,28.57
N$305  (via drill 0.95 pad 1.7)
  other vias: 49.8,28.57
N$306  (via drill 0.95 pad 1.7)
  other vias: 80.28,33.66
N$307  (via drill 0.95 pad 1.7)
  other vias: 47.26,31.11
N$308  (via drill 0.95 pad 1.7)
  other vias: 82.82,15.88
N$309  (via drill 0.95 pad 1.7)
  other vias: 52.34,31.11
N$310  (via drill 0.95 pad 1.7)
  other vias: 49.8,31.11
N$311  (via drill 0.95 pad 1.7)
  other vias: 44.72,31.11
N$312  (via drill 0.95 pad 1.7)
  other vias: 44.72,33.66
N$313  (via drill 0.95 pad 1.7)
  other vias: 47.26,33.66
N$314  (via drill 0.95 pad 1.7)
  other vias: 34.56,18.41
N$315  (via drill 0.95 pad 1.7)
  other vias: 37.1,18.41
N$316  (via drill 0.95 pad 1.7)
  other vias: 47.26,15.88
N$317  (via drill 0.95 pad 1.7)
  other vias: 49.8,18.41
N$318  (via drill 0.95 pad 1.7)
  other vias: 52.34,18.41
N$319  (via drill 0.95 pad 1.7)
  other vias: 52.34,20.95
N$320  (via drill 0.95 pad 1.7)
  other vias: 57.42,18.41
N$321  (via drill 0.95 pad 1.7)
  other vias: 70.12,15.88
N$322  (via drill 0.95 pad 1.7)
  other vias: 67.58,13.34
N$323  (via drill 0.95 pad 1.7)
  other vias: 62.5,15.88
N$328  (via drill 0.95 pad 1.7)
  other vias: 82.82,31.11
N$329  (via drill 0.95 pad 1.7)
  other vias: 37.1,23.5
N$330  (via drill 0.95 pad 1.7)
  other vias: 82.82,28.57
N$331  (via drill 0.95 pad 1.7)
  other vias: 39.64,26.04
N$332  (via drill 0.95 pad 1.7)
  other vias: 39.64,23.5
N$333  (via drill 0.95 pad 1.7)
  other vias: 82.82,26.04
N$334  (via drill 0.95 pad 1.7)
  other vias: 82.82,23.5
N$335  (via drill 0.95 pad 1.7)
  other vias: 42.18,26.04
N$336  (via drill 0.95 pad 1.7)
  other vias: 34.56,23.5
N$337  (via drill 0.95 pad 1.7)
  other vias: 82.82,20.95
N$340  (via drill 0.95 pad 1.7)
  other vias: 82.82,18.41
N$343  (via drill 0.95 pad 1.7)
  other vias: 82.82,36.2
N$344  (via drill 0.95 pad 1.7)
  other vias: 82.82,33.66
N$345  (via drill 0.95 pad 1.7)
  other vias: 44.72,23.5
N$346  (via drill 0.95 pad 1.7)
  other vias: 42.18,23.5
N$347  (via drill 0.95 pad 1.7)
  other vias: 47.26,23.5
N$348  (via drill 0.95 pad 1.7)
  other vias: 52.34,23.5
N$349  (via drill 0.95 pad 1.7)
  other vias: 49.8,23.5
N$350  (via drill 0.95 pad 1.7)
  other vias: 52.34,26.04
N$351  (via drill 0.95 pad 1.7)
  other vias: 49.8,26.04
N$352  (via drill 0.95 pad 1.7)
  other vias: 47.26,26.04
N$368  (via drill 0.95 pad 1.7)
  other vias: 62.5,13.34
N$369  (via drill 0.95 pad 1.7)
  other vias: 59.96,13.34
N$370  (via drill 0.95 pad 1.7)
  other vias: 57.42,13.34
N$371  (via drill 0.95 pad 1.7)
  other vias: 54.88,13.34
N$372  (via drill 0.95 pad 1.7)
  other vias: 52.34,13.34
N$373  (via drill 0.95 pad 1.7)
  other vias: 49.8,13.34
N$374  (via drill 0.95 pad 1.7)
  other vias: 47.26,13.34
N$375  (via drill 0.95 pad 1.7)
  other vias: 42.18,13.34
N$376  (via drill 0.95 pad 1.7)
  other vias: 49.8,15.88
N$377  (via drill 0.95 pad 1.7)
  other vias: 52.34,15.88
N$378  (via drill 0.95 pad 1.7)
  other vias: 54.88,15.88
N$379  (via drill 0.95 pad 1.7)
  other vias: 57.42,15.88
N$380  (via drill 0.95 pad 1.7)
  other vias: 59.96,18.41
N$381  (via drill 0.95 pad 1.7)
  other vias: 54.88,18.41
N$382  (via drill 0.95 pad 1.7)
  other vias: 44.72,26.04
N$383  (via drill 0.95 pad 1.7)
  other vias: 57.42,20.95
N$384  (via drill 0.95 pad 1.7)
  other vias: 57.42,23.5
N$385  (via drill 0.95 pad 1.7)
  other vias: 62.5,20.95
N$386  (via drill 0.95 pad 1.7)
  other vias: 57.42,26.04
N$387  (via drill 0.95 pad 1.7)
  other vias: 54.88,26.04
N$388  (via drill 0.95 pad 1.7)
  other vias: 54.88,23.5
N$389  (via drill 0.95 pad 1.7)
  other vias: 21.86,13.34
N$390  (via drill 0.95 pad 1.7)
  other vias: 21.86,15.88
N$392  (via drill 0.95 pad 1.7)
  other vias: 19.32,13.34
N$393  (via drill 0.95 pad 1.7)
  other vias: 59.96,23.5
N$394  (via drill 0.95 pad 1.7)
  other vias: 19.32,15.88
N$395  (via drill 0.95 pad 1.7)
  other vias: 57.42,28.57
N$396  (via drill 0.95 pad 1.7)
  other vias: 62.5,28.57
N$398  (via drill 0.95 pad 1.7)
  other vias: 62.5,31.11
N$399  (via drill 0.95 pad 1.7)
  other vias: 59.96,31.11
N$400  (via drill 0.95 pad 1.7)
  other vias: 54.88,31.11
N$402  (via drill 0.95 pad 1.7)
  other vias: 59.96,33.66
N$403  (via drill 0.95 pad 1.7)
  other vias: 62.5,33.66
N$404  (via drill 0.95 pad 1.7)
  other vias: 65.04,36.2
N$405  (via drill 0.95 pad 1.7)
  other vias: 62.5,36.2
N$406  (via drill 0.95 pad 1.7)
  other vias: 59.96,36.2
N$407  (via drill 0.95 pad 1.7)
  other vias: 57.42,36.2
N$408  (via drill 0.95 pad 1.7)
  other vias: 57.42,33.66
N$409  (via drill 0.95 pad 1.7)
  other vias: 54.88,36.2
N$410  (via drill 0.95 pad 1.7)
  other vias: 54.88,33.66
N$411  (via drill 0.95 pad 1.7)
  other vias: 49.8,33.66
N$412  (via drill 0.95 pad 1.7)
  other vias: 52.34,36.2
N$413  (via drill 0.95 pad 1.7)
  other vias: 49.8,36.2
N$414  (via drill 0.95 pad 1.7)
  other vias: 47.26,36.2
N$415  (via drill 0.95 pad 1.7)
  other vias: 42.18,36.2
N$416  (via drill 0.95 pad 1.7)
  other vias: 39.64,38.73
N$417  (via drill 0.95 pad 1.7)
  other vias: 44.72,38.73
N$418  (via drill 0.95 pad 1.7)
  other vias: 42.18,38.73
N$419  (via drill 0.95 pad 1.7)
  other vias: 47.26,38.73
N$420  (via drill 0.95 pad 1.7)
  other vias: 49.8,38.73
N$421  (via drill 0.95 pad 1.7)
  other vias: 52.34,38.73
N$422  (via drill 0.95 pad 1.7)
  other vias: 54.88,38.73
N$430  (via drill 0.95 pad 1.7)
  other vias: 52.34,41.27
N$431  (via drill 0.95 pad 1.7)
  other vias: 54.88,41.27
N$432  (via drill 0.95 pad 1.7)
  other vias: 49.8,41.27
N$433  (via drill 0.95 pad 1.7)
  other vias: 47.26,41.27
N$434  (via drill 0.95 pad 1.7)
  other vias: 44.72,41.27
N$435  (via drill 0.95 pad 1.7)
  other vias: 42.18,41.27
N$436  (via drill 0.95 pad 1.7)
  other vias: 37.1,41.27
N$441  (via drill 0.95 pad 1.7)
  other vias: 70.12,13.34
N$442  (via drill 0.95 pad 1.7)
  other vias: 72.66,13.34
N$443  (via drill 0.95 pad 1.7)
  other vias: 75.2,13.34
N$444  (via drill 0.95 pad 1.7)
  other vias: 77.74,13.34
N$445  (via drill 0.95 pad 1.7)
  other vias: 80.28,13.34
N$446  (via drill 0.95 pad 1.7)
  other vias: 82.82,13.34
N$468  (via drill 0.95 pad 1.7)
  other vias: 67.58,36.2
SCK  (via drill 0.61)
  Top 0.254: ICSP.3 5.98,52.39 7.41,50.96 7.41,50.32 7.57,50.16 7.57,47.15 7.89,46.83 v7.89,45.09 | v43.45,11.27 v43.45,45.88
  Bottom 0.254: JP9.33 94.73,12.7 93.46,13.97 92.5,13.97 91.23,12.7 JP10.33 89.17,12.7 87.27,10.79 43.93,10.79 v43.45,11.27 | v7.89,45.09 24.08,45.09 25.35,46.35 40.12,46.35 40.59,45.88 v43.45,45.88
SO1
  Top 0.254: U1.1 4.71,22.54 4.08,21.91 JP1.1
SO2
  Top 0.254: U1.2 5.98,21.91 5.35,21.27 5.35,20 4.71,19.37 4.08,19.37 JP2.1
SO3
  Top 0.254: U1.3 7.26,22.54 6.62,21.91 JP1.2
SO4
  Top 0.254: U1.4 8.53,22.07 7.73,21.27 7.73,20.48 6.62,19.37 JP2.2
SO5
  Top 0.254: U1.5 9.79,22.54 9.16,21.91 JP1.3
SO6
  Top 0.254: U1.6 11.06,22.07 10.43,21.43 10.43,20.48 9.16,19.21 JP2.3
SO7
  Top 0.254: U1.7 12.33,22.54 11.7,21.91 JP1.4
SO8
  Top 0.254: U1.8 13.61,22.07 12.97,21.43 12.97,20.48 11.7,19.21 JP2.4
SO9
  Top 0.254: U1.9 14.88,22.54 14.24,21.91 JP1.5
SO10
  Top 0.254: U1.10 16.14,22.07 15.51,21.43 15.51,20.48 14.24,19.21 JP2.5
SO11
  Top 0.254: U1.11 17.41,22.54 16.78,21.91 JP1.6
SO12
  Top 0.254: U1.12 18.68,22.07 18.05,21.43 18.05,20.48 16.78,19.21 JP2.6
SO13
  Top 0.254: U1.13 19.95,22.54 19.32,21.91 JP1.7
SO14
  Top 0.254: U1.14 21.22,22.07 20.59,21.43 20.59,20.48 19.32,19.21 JP2.7
SO15
  Top 0.254: U1.15 21.22,35.08 20.59,35.72 20.59,36.67 19.32,37.94 JP6.7
SO16
  Top 0.254: U1.16 19.95,34.61 19.32,35.24 JP5.7
SO17
  Top 0.254: U1.17 18.68,35.08 18.05,35.72 18.05,36.67 16.78,37.94 JP6.6
SO18
  Top 0.254: U1.18 17.41,34.61 16.78,35.24 JP5.6
SO19
  Top 0.254: U1.19 16.14,35.08 15.51,35.72 15.51,36.67 14.24,37.94 JP6.5
SO20
  Top 0.254: U1.20 14.88,34.61 14.24,35.24 JP5.5
SO21
  Top 0.254: U1.21 13.61,35.08 12.97,35.72 12.97,36.67 11.7,37.94 JP6.4
SO22
  Top 0.254: U1.22 12.33,34.61 11.7,35.24 JP5.4
SO23
  Top 0.254: U1.23 11.06,35.08 10.43,35.72 10.43,36.67 9.16,37.94 JP6.3
SO24
  Top 0.254: U1.24 9.79,34.61 9.16,35.24 JP5.3
SO25
  Top 0.254: U1.25 8.53,35.08 7.73,35.88 7.73,36.67 6.62,37.78 JP6.2
SO26
  Top 0.254: U1.26 7.26,34.61 6.62,35.24 JP5.2
SO27
  Top 0.254: U1.27 5.98,35.24 5.35,35.88 5.35,37.15 4.71,37.78 4.08,37.78 JP6.1
SO28
  Top 0.254: U1.28 4.71,34.61 4.08,35.24 JP5.1
VIN
  Top 0.813: PWR.6 J10.6

### Text on the board
tPlace: ICSP | 9 | 8 | 7 | 6 | 5 | 4 | 3 | 2 | GND | 13 | 12 | 11 | 10 | AREF | SDA | SCL | TX31 | RX31 | TX21 | RX21 | TX11 | RX11 | TX> 1 | RX< 0 | RST | 3V3 | 5V | GND | GND | VIN | 0 | 1 | 2 | 3 | 4 | 5 | 6 | 7 | 9 | 9 | 10 | 11 | 12 | 13 | 14 | 15 | STAT | Arduino MEGA Prototype Shield v3 | PWR